# Altium schematic sheet MCISO-S04-V00-Microcontroller.SchDoc: AMU Microcontroller
size A3; DrawnBy: Thomas Benedetti; DocumentNumber: 4; Revision: 01; SheetNumber: 2; SheetTotal: 8; Version: 01; Project: AMU 2020; PageSetup: Record=PageOptions|CenterHorizontal=True|CenterVertical=True|PrintScale=0.97|XCorrection=1.00|YCorrection=1.00|PrintKind=0|BorderSize=5000000|LeftOffset=0|BottomOffset=0|Orientation=2|PaperLength=1000|PaperWidth=1000|Scale=100|PaperSource=7|PrintQuality=-4|MediaType=1|DitherType=10|PaperKind=A4|PrintScaleMode=1
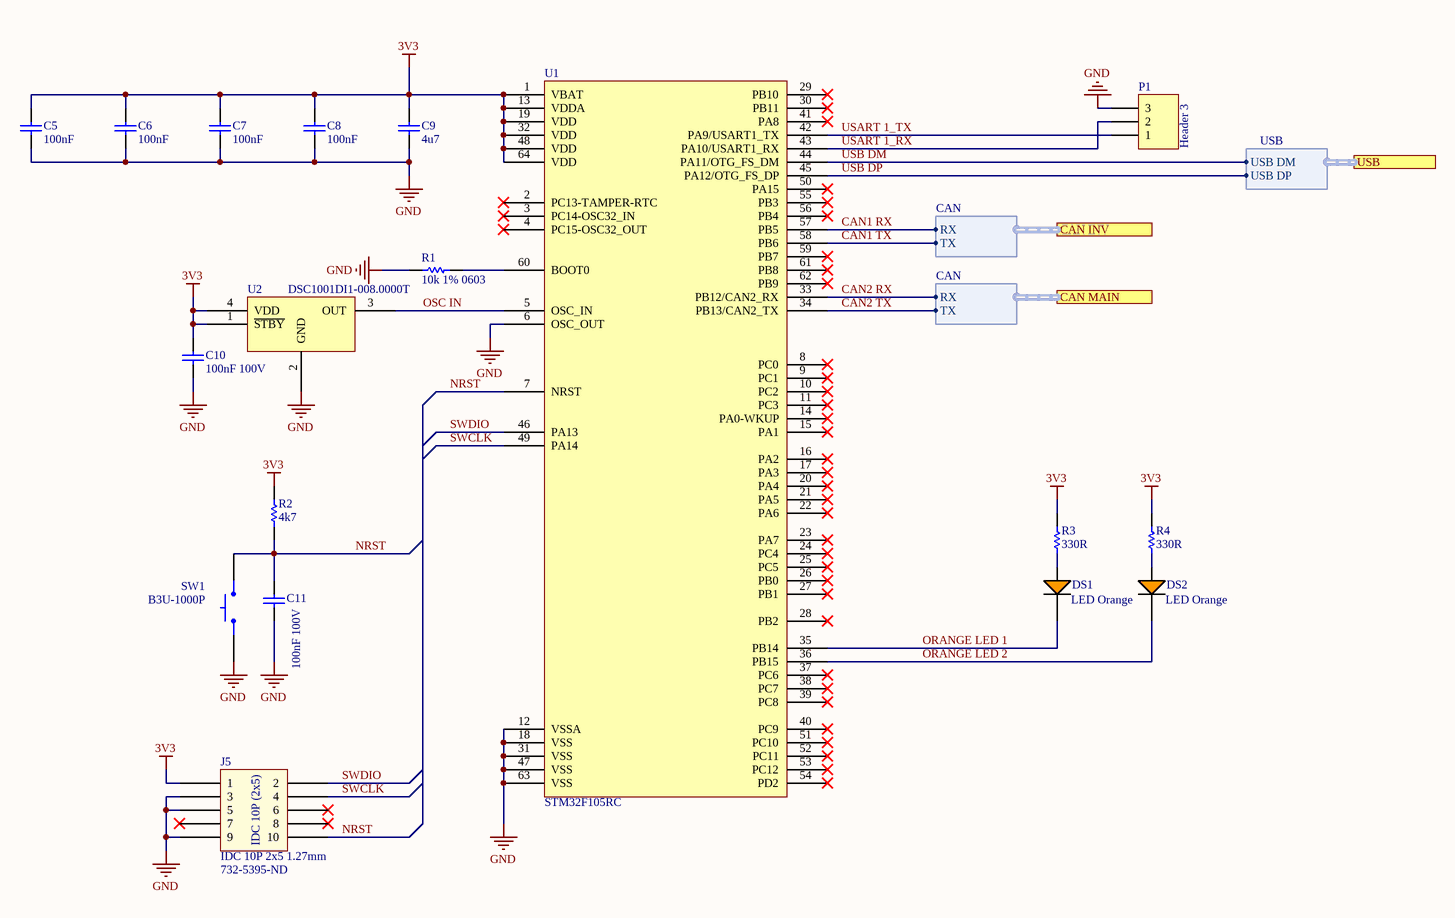
[diagram p0: MCISO-S04-V00-Microcontroller.SchDoc]

## Parts
C5  100nF  [Cap_Ceramic_0603]
C6  100nF  [Cap_Ceramic_0603]
C7  100nF  [Cap_Ceramic_0603]
C8  100nF  [Cap_Ceramic_0603]
C9  4u7  [Cap_Ceramic_0603]
C10  100nF 100V  [Cap_Ceramic_0603]
C11  100nF 100V  [Cap_Ceramic_0603]
DS1  LED Orange  [LED ORANGE 0603]
DS2  LED Orange  [LED ORANGE 0603]
J5  IDC 10P 2x5 1.27mm  [IDC 1.27MM 10P]
P1  Header 3  [HDR1X3]
R1  10k 1% 0603  [Res_ThinFilm_0603]
R2  4k7  [Res_ThinFilm_0603]
R3  330R  [Res_ThinFilm_0603]
R4  330R  [Res_ThinFilm_0603]
SW1  B3U-1000P  [BTN B3U-1000P]
U1  STM32F105RC  [STM32F105RC]
U2  DSC1001DI1-008.0000T  [DSC1001DI1-008.0000TCT-ND]

## Ports
CAN INV (harness CAN), CAN MAIN (harness CAN), USB (harness USB)

## Harnesses
CAN: TX, RX
CAN: RX, TX
USB: USB DM, USB DP

## Nets
3V3: C5.2 C6.2 C7.2 C8.2 C9.2 C10.2 J5.1 R2.2 R3.2 R4.2 U1.1(VBAT) U1.13(VDDA) U1.19(VDD) U1.32(VDD) U1.48(VDD) U1.64(VDD) U2.1(~{STBY}) U2.4(VDD)
GND: C5.1 C6.1 C7.1 C8.1 C9.1 C10.1 C11.1 J5.3 J5.5 J5.9 P1.3 R1.1 SW1.1 U1.6(OSC_OUT) U1.12(VSSA) U1.18(VSS) U1.31(VSS) U1.47(VSS) U1.63(VSS) U2.2(GND)
CAN1 RX: U1.57(PB5) ; port CAN INV.RX
CAN1 TX: U1.58(PB6) ; port CAN INV.TX
CAN2 RX: U1.33(PB12/CAN2_RX) ; port CAN MAIN.RX
CAN2 TX: U1.34(PB13/CAN2_TX) ; port CAN MAIN.TX
NRST: C11.2 J5.10 R2.1 SW1.2 U1.7(NRST)
ORANGE LED 1: DS1.2(C) U1.35(PB14)
ORANGE LED 2: DS2.2(C) U1.36(PB15)
OSC IN: U1.5(OSC_IN) U2.3(OUT)
SWCLK: J5.4 U1.49(PA14)
SWDIO: J5.2 U1.46(PA13)
USART 1_RX: P1.2 U1.43(PA10/USART1_RX)
USART 1_TX: P1.1 U1.42(PA9/USART1_TX)
USB DM: U1.44(PA11/OTG_FS_DM) ; port USB.USB DM
USB DP: U1.45(PA12/OTG_FS_DP) ; port USB.USB DP
NetDS1_1: DS1.1(A) R3.1
NetDS2_1: DS2.1(A) R4.1
NetR1_2: R1.2 U1.60(BOOT0)

Not connected (* = marked no-connect by the designer): J5 6* 7* 8*; U1 2(PC13-TAMPER-RTC)* 3(PC14-OSC32_IN)* 4(PC15-OSC32_OUT)* 8(PC0)* 9(PC1)* 10(PC2)* 11(PC3)* 14(PA0-WKUP)* 15(PA1)* 16(PA2)* 17(PA3)* 20(PA4)* 21(PA5)* 22(PA6)* 23(PA7)* 24(PC4)* 25(PC5)* 26(PB0)* 27(PB1)* 28(PB2)* 29(PB10)* 30(PB11)* 37(PC6)* 38(PC7)* 39(PC8)* 40(PC9)* 41(PA8)* 50(PA15)* 51(PC10)* 52(PC11)* 53(PC12)* 54(PD2)* 55(PB3)* 56(PB4)* 59(PB7)* 61(PB8)* 62(PB9)*

## Notes on the sheet
- (near J5) 732-5395-ND
- Revision History:
- Sheet Title:
- Rev
- Date
- Description
- Project:
- Size:
- Drawn By:
- A3
- Number:
- Revision:
- Sheet
- Version:
- of
- QUT Motorsport
- O-120, Gardens Point
- 2 George Street
- Brisbane, QLD 4000
- Australia
- Print Date:
- Print Time:
- File Name:
- (in symbol IDC 10P 2x5 1.27mm) IDC 10P (2x5)

## Library data of the parts
C5-C8 = 100nF 50V 5% X7R 0603: Capacitor, Ceramic, SMD, 100nF, 50V, 5%, X7R, 0603
C9 = 4u7 50V 5% X7R 0603: Capacitor, Ceramic, SMD, 4u7, 50V, 5%, X7R, 0603
C10 C11 = 100nF 100V 5% X7R 0603: Capacitor, Ceramic, SMD, 100nF, 100V, 5%, X7R, 0603
DS1 DS2 = LED ORANGE 0603
P1 = Header 3: Header, 3-Pin; LatestRevisionDate: 17-Jul-2002; LatestRevisionNote: Re-released for DXP Platform.; Publisher: Altium Limited
R1 = 20k 1% 0603: Resistor, SMD, 20k, 0.1W, 5%, 0603
R2 = 4k7 5% 0603: Resistor, SMD, 4k7, 0.1W, 5%, 0603
R3 R4 = 330R 5% 0603: Resistor, SMD, 330R, 0.1W, 5%, 0603
SW1 = BTN B3U-1000P: Omron B3U-1000P Ultra Miniture Switch; ComponentLink1Description: LCSC; ComponentLink1URL: https://lcsc.com/product-detail/Tactile-Switches_BRIGHT-TSA063G50-250_C294565.html
U1 = STM32F105RC: ARM® Cortex®-M3 STM32F1 Microcontroller IC 32-Bit 72MHz 256KB (256K x 8) FLASH 64-LQFP (10x10); ComponentLink1Description: Digikey; ComponentLink1URL: https://www.digikey.com.au/product-detail/en/stmicroelectronics/STM32F105RCT6TR/497-17397-1-ND/8024118; ComponentLink2Description: Datasheet; ComponentLink2URL: https://www.st.com/content/ccc/resource/technical/document/datasheet/e4/f3/1a/89/5a/02/46/ae/CD00220364.pdf/files/CD00220364.pdf/jcr:content/translations/en.CD00220364.pdf
U2 = DSC1001DI1-008.0000T: on 8MHz XO (Standard) CMOS Oscillator 1.8 ~ 3.3V Standby (Power Down) 4-SMD, No Lead